# Altium schematic sheet Sheet1.SchDoc
size A4; SheetNumber: 1; SheetTotal: 1
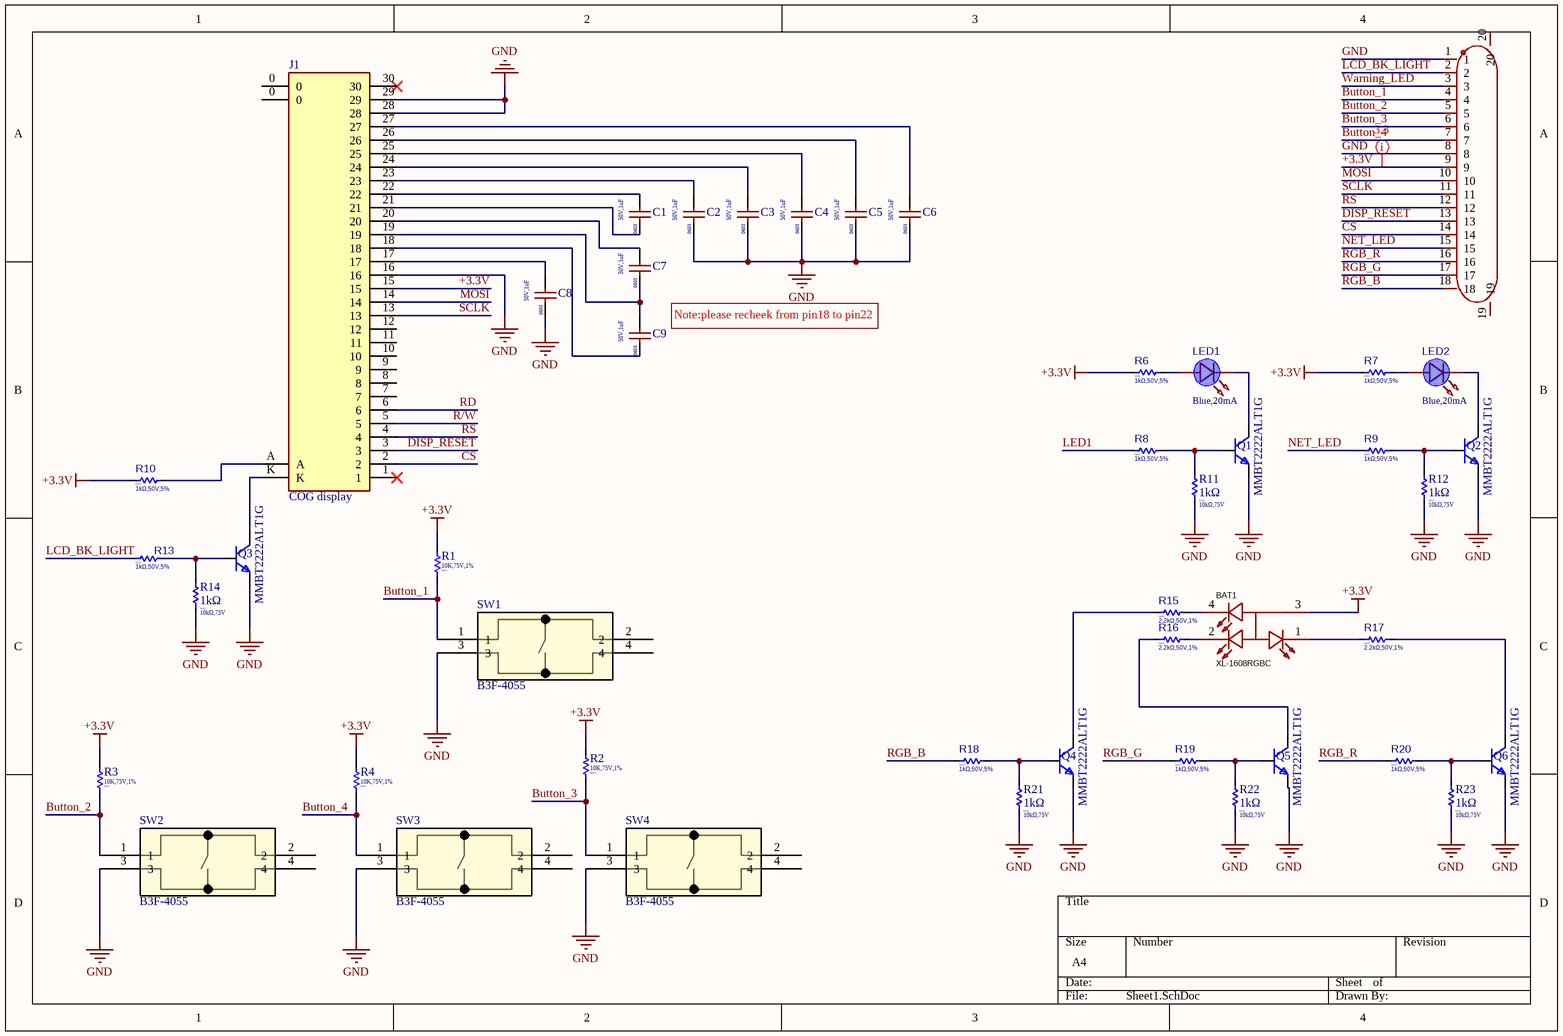
[diagram p0: Sheet1.SchDoc]

## Parts
BAT1  XL-1608RGBC  [LED RGB 0603]
C1  value 50V,1uF  Package: 0603  [C0603]  (hidden comment: 1uF)
C2  value 50V,1uF  Package: 0603  [C0603]  (hidden comment: 1uF)
C3  value 50V,1uF  Package: 0603  [C0603]  (hidden comment: 1uF)
C4  value 50V,1uF  Package: 0603  [C0603]  (hidden comment: 1uF)
C5  value 50V,1uF  Package: 0603  [C0603]  (hidden comment: 1uF)
C6  value 50V,1uF  Package: 0603  [C0603]  (hidden comment: 1uF)
C7  value 50V,1uF  Package: 0603  [C0603]  (hidden comment: 1uF)
C8  value 50V,1uF  Package: 0603  [C0603]  (hidden comment: 1uF)
C9  value 50V,1uF  Package: 0603  [C0603]  (hidden comment: 1uF)
FPC1  FPC-05F-18PH20  [FPC-SMD_18P-P0.50_horizontal]  (value not drawn)
J1  COG display  [COG]
LED1  value Blue,20mA  [LED 0402]  (hidden comment: TJ-S1005CL4T5ALC6B-A5)
LED2  value Blue,20mA  [LED 0402]  (hidden comment: TJ-S1005CL4T5ALC6B-A5)
Q1  MMBT2222ALT1G  [SOT-23]
Q2  MMBT2222ALT1G  [SOT-23]
Q3  MMBT2222ALT1G  [SOT-23]
Q4  MMBT2222ALT1G  [SOT-23]
Q5  MMBT2222ALT1G  [SOT-23]
Q6  MMBT2222ALT1G  [SOT-23]
R1  Package: 0603  [R0603]  (hidden comment: 10K,75V,1%)
R2  Package: 0603  [R0603]  (hidden comment: 10K,75V,1%)
R3  Package: 0603  [R0603]  (hidden comment: 10K,75V,1%)
R4  Package: 0603  [R0603]  (hidden comment: 10K,75V,1%)
R6  value 1kΩ,50V,5%  Package: 0402  [R0402]  (hidden comment: 1K)
R7  value 1kΩ,50V,5%  Package: 0402  [R0402]  (hidden comment: 1K)
R8  value 1kΩ,50V,5%  Package: 0402  [R0402]  (hidden comment: 1K)
R9  value 1kΩ,50V,5%  Package: 0402  [R0402]  (hidden comment: 1K)
R10  value 1kΩ,50V,5%  Package: 0402  [R0402]  (hidden comment: 1K)
R11  1kΩ  value 10kΩ,75V  Package: 0402  [R0402]
R12  1kΩ  value 10kΩ,75V  Package: 0402  [R0402]
R13  value 1kΩ,50V,5%  Package: 0402  [R0402]  (hidden comment: 1K)
R14  1kΩ  value 10kΩ,75V  Package: 0402  [R0402]
R15  value 2.2kΩ,50V,1%  Package: 0402  [R0402]  (hidden comment: 2.2KΩ)
R16  value 2.2kΩ,50V,1%  Package: 0402  [R0402]  (hidden comment: 2.2KΩ)
R17  value 2.2kΩ,50V,1%  Package: 0402  [R0402]  (hidden comment: 2.2KΩ)
R18  value 1kΩ,50V,5%  Package: 0402  [R0402]  (hidden comment: 1K)
R19  value 1kΩ,50V,5%  Package: 0402  [R0402]  (hidden comment: 1K)
R20  value 1kΩ,50V,5%  Package: 0402  [R0402]  (hidden comment: 1K)
R21  1kΩ  value 10kΩ,75V  Package: 0402  [R0402]
R22  1kΩ  value 10kΩ,75V  Package: 0402  [R0402]
R23  1kΩ  value 10kΩ,75V  Package: 0402  [R0402]
SW1  B3F-4055  [SW_B3F-4050_OMR]
SW2  B3F-4055  [SW_B3F-4050_OMR]
SW3  B3F-4055  [SW_B3F-4050_OMR]
SW4  B3F-4055  [SW_B3F-4050_OMR]

## Nets
+3.3V: BAT1.3(com) FPC1.9 J1.15 R1.2 R2.2 R3.2 R4.2 R6.1 R7.1 R10.1
GND: C2.1 C3.1 C4.1 C5.1 C6.1 C8.1 FPC1.1 FPC1.8 J1.16 J1.28 J1.29 Q1.2 Q2.2 Q3.2 Q4.2 Q5.2 Q6.2 R11.1 R12.1 R14.1 R21.1 R22.1 R23.1 SW1.3 SW2.3 SW3.3 SW4.3
Button_1: FPC1.4 R1.1 SW1.1
Button_2: FPC1.5 R3.1 SW2.1
Button_3: FPC1.6 R2.1 SW4.1
Button_4: FPC1.7 R4.1 SW3.1
CS: FPC1.14 J1.2
DISP_RESET: FPC1.13 J1.3
LCD_BK_LIGHT: FPC1.2 R13.1
LED1: R8.1
MOSI: FPC1.10 J1.14
NET_LED: FPC1.15 R9.1
R/W: J1.5
RD: J1.6
RGB_B: FPC1.18 R18.1
RGB_G: FPC1.17 R19.1
RGB_R: FPC1.16 R20.1
RS: FPC1.12 J1.4
SCLK: FPC1.11 J1.13
Warning_LED: FPC1.3
NetBAT1_1: BAT1.1 R17.1
NetBAT1_2: BAT1.2 R16.1
NetBAT1_4: BAT1.4 R15.1
NetC1_1: C1.1 J1.21
NetC1_2: C1.2 J1.22
NetC2_2: C2.2 J1.23
NetC3_2: C3.2 J1.24
NetC4_2: C4.2 J1.25
NetC5_2: C5.2 J1.26
NetC6_2: C6.2 J1.27
NetC7_1: C7.1 C9.2 J1.19
NetC7_2: C7.2 J1.20
NetC8_2: C8.2 J1.17
NetC9_1: C9.1 J1.18
NetJ1_A: J1.A R10.2
NetJ1_K: J1.K Q3.3
NetLED1_1: LED1.1(K) Q1.3
NetLED1_2: LED1.2(A) R6.2
NetLED2_1: LED2.1(K) Q2.3
NetLED2_2: LED2.2(A) R7.2
NetQ1_1: Q1.1 R8.2 R11.2
NetQ2_1: Q2.1 R9.2 R12.2
NetQ3_1: Q3.1 R13.2 R14.2
NetQ4_1: Q4.1 R18.2 R21.2
NetQ4_3: Q4.3 R15.2
NetQ5_1: Q5.1 R19.2 R22.2
NetQ5_3: Q5.3 R16.2
NetQ6_1: Q6.1 R20.2 R23.2
NetQ6_3: Q6.3 R17.2

Not connected (* = marked no-connect by the designer): FPC1 19 20; J1 0 1* 7 8 9 10 11 12 30*; SW1 2 4; SW2 2 4; SW3 2 4; SW4 2 4

## Layout directives
net class 3.3: +3.3V

## Notes on the sheet
- Note:please recheek from pin18 to pin22

## Library data of the parts
BAT1 = XL-1608RGBC: 0603 RGB LEDs ROHS; Manufacturer: XINGLIGHT; LCSC: C5349936; MPN: XL-1608RGBC; Package: 0603; Datasheet: https://atta.szlcsc.com/upload/public/pdf/source/20240218/D6E53B1911387F9E4C84048A3296A5A3.pdf; Operating Temperature: -30℃~+85℃
C1-C9 = 0603B105K500NT: 50V 1uF X7R ±10% 0603 Multilayer Ceramic Capacitors MLCC - SMD/SMT ROHS; Manufacturer: FH; Datasheet: https://www.lcsc.com/datasheet/lcsc_datasheet_2304140030_FH--Guangdong-Fenghua-Advanced-Tech-0603B105K500NT_C90540.pdf; LCSC: C90540; MPN: 0603B105K500NT
FPC1 = FPC-05F-18PH20: Flip type -25℃~+85℃ 18P Bottom Contact Horizontal attachment 0.5mm SMD,P=0.5mm,Surface Mount，Right Angle FFC, FPC; Manufacturer: XUNPU; LCSC: C2856802; MPN: FPC-05F-18PH20; Package: SMD,P=0.5mm,卧贴; Datasheet: https://atta.szlcsc.com/upload/public/pdf/source/20210922/C2856802_2A845D1961F33AEC1ED22CECB292335F.pdf; Operating Temperature Range: -25℃~+85℃
J1 = COG display: FPC CONNECTOR; Manufacturer: XFCN; Datasheet: https://datasheet.lcsc.com/lcsc/2304140030_XFCN-F0501-B-30-20T-R_C481233.pdf; LCSC: C481233
LED1 LED2 = TJ-S1005CL4T5ALC6B-A5: 20mA Colorless transparent lens -40℃~+80℃ 465nm~470nm Blue 120° 111mW 0402 LED Indication - Discrete ROHS; Manufacturer: TOGIALED; Datasheet: https://www.lcsc.com/datasheet/lcsc_datasheet_2011180235_TOGIALED-TJ-S1005CL4T5ALC6B-A5_C917189.pdf; LCSC: C917189; MPN: TJ-S1005CL4T5ALC6B-A5; Package: 0402
Q1-Q6 = MMBT2222ALT1G: Bipolar (BJT) Transistor NPN 40 V 600 mA 300MHz 225 mW Surface Mount SOT-23-3 (TO-236); Manufacturer: ON Semiconductor; Max Operating Temp: +150°C; Min Operating Temp: -55°C; MPN: MMBT2222ALT1G; Package: SOT-23
R1-R4 = 0603WAF1002T5E: 100mW Thick Film Resistors ±100ppm/℃ ±1% 10kΩ 0603 Chip Resistor - Surface Mount ROHS; Manufacturer: UNI-ROYAL(Uniroyal Elec); Max Operating Temp: 155℃; Min Operating Temp: -55℃; MPN: 0603WAF1002T5E; Datasheet: https://datasheet.lcsc.com/szlcsc/Uniroyal-Elec-0603WAF1002T5E_C25804.pdf; LCSC: C25804; Value: 10K,75V,1%
R6-R10 R13 R18-R20 = SR0402JR-7W1KL: 125mW Thick Film Resistors 50V ±200ppm/℃ ±5% 1kΩ 0402 Chip Resistor - Surface Mount ROHS; Manufacturer: YAGEO; Max Operating Temp: +155; MPN: SR0402JR-7W1KL; Type: *; Datasheet: https://datasheet.lcsc.com/lcsc/2304140030_YAGEO-RC0402FR-072K7L_C138017.pdf; Min Operating Temp: -55; LCSC: C2085102
R11 R12 R14 R21-R23 = 0402WGF1001TCE: 62.5mW Thick Film Resistors ±100ppm/℃ ±1% 1kΩ 0402 Chip Resistor - Surface Mount ROHS; Manufacturer: UNI-ROYAL(Uniroyal Elec); MPN: 0603WAF1002T5E; Datasheet: https://datasheet.lcsc.com/szlcsc/Uniroyal-Elec-0603WAF1002T5E_C25804.pdf; LCSC: C25804
R15-R17 = RC0402FR-072K2L: 62.5mW Thick Film Resistors 50V ±100ppm/℃ ±1% 2.2kΩ 0402 Chip Resistor - Surface Mount ROHS; Manufacturer: YAGEO; Max Operating Temp: +155; MPN: RC0402FR-072K2L; Datasheet: https://datasheet.lcsc.com/lcsc/2304140030_YAGEO-RC0402FR-072K2L_C114762.pdf; Min Operating Temp: -55; LCSC: C114762
SW1-SW4 = B3F-4055: Tactile Switch SPST-NO Top Actuated Through Hole; Mfr_Name: Omron; RefDes: RefDes; Type: Type